# Altium schematic sheet 01_SYSTEM.SchDoc: LORA_NODE_SYSYTEM
size A4
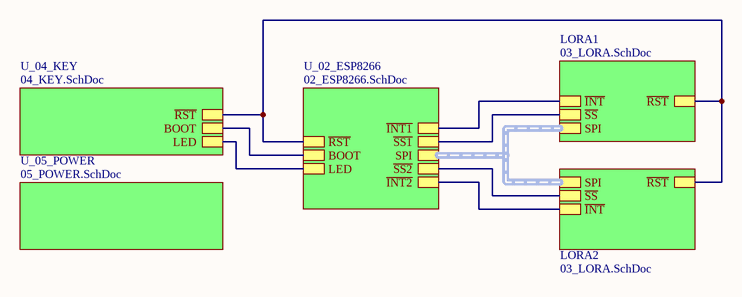
[diagram p0: 01_SYSTEM.SchDoc]

## Sub-sheets
LORA1 = 03_LORA.SchDoc: SPI (harness SPI), ~{RST}, ~{SS}, ~{INT}
LORA2 = 03_LORA.SchDoc: SPI (harness SPI), ~{RST}, ~{SS}, ~{INT}
U_02_ESP8266 = 02_ESP8266.SchDoc: SPI (harness SPI), ~{RST}, ~{SS1}, ~{SS2}, BOOT, ~{INT1}, ~{INT2}, LED
U_04_KEY = 04_KEY.SchDoc: ~{RST}, BOOT, LED
U_05_POWER = 05_POWER.SchDoc: no entries

## Nets
(unnamed): sheet U_02_ESP8266/~{RST}, sheet LORA1/~{RST}, sheet LORA2/~{RST}, sheet U_04_KEY/~{RST}
(unnamed): sheet U_02_ESP8266/~{SS1}, sheet LORA1/~{SS}
(unnamed): sheet U_02_ESP8266/~{SS2}, sheet LORA2/~{SS}
(unnamed): sheet U_02_ESP8266/BOOT, sheet U_04_KEY/BOOT
(unnamed): sheet U_02_ESP8266/~{INT1}, sheet LORA1/~{INT}
(unnamed): sheet U_02_ESP8266/~{INT2}, sheet LORA2/~{INT}
(unnamed): sheet U_02_ESP8266/LED, sheet U_04_KEY/LED

## Buses and harness runs
harness sheet LORA1/SPI = sheet LORA2/SPI = sheet U_02_ESP8266/SPI